# Altium schematic sheet AT32UC3B0256 Breakout Top Assembly.SchDoc
size Letter
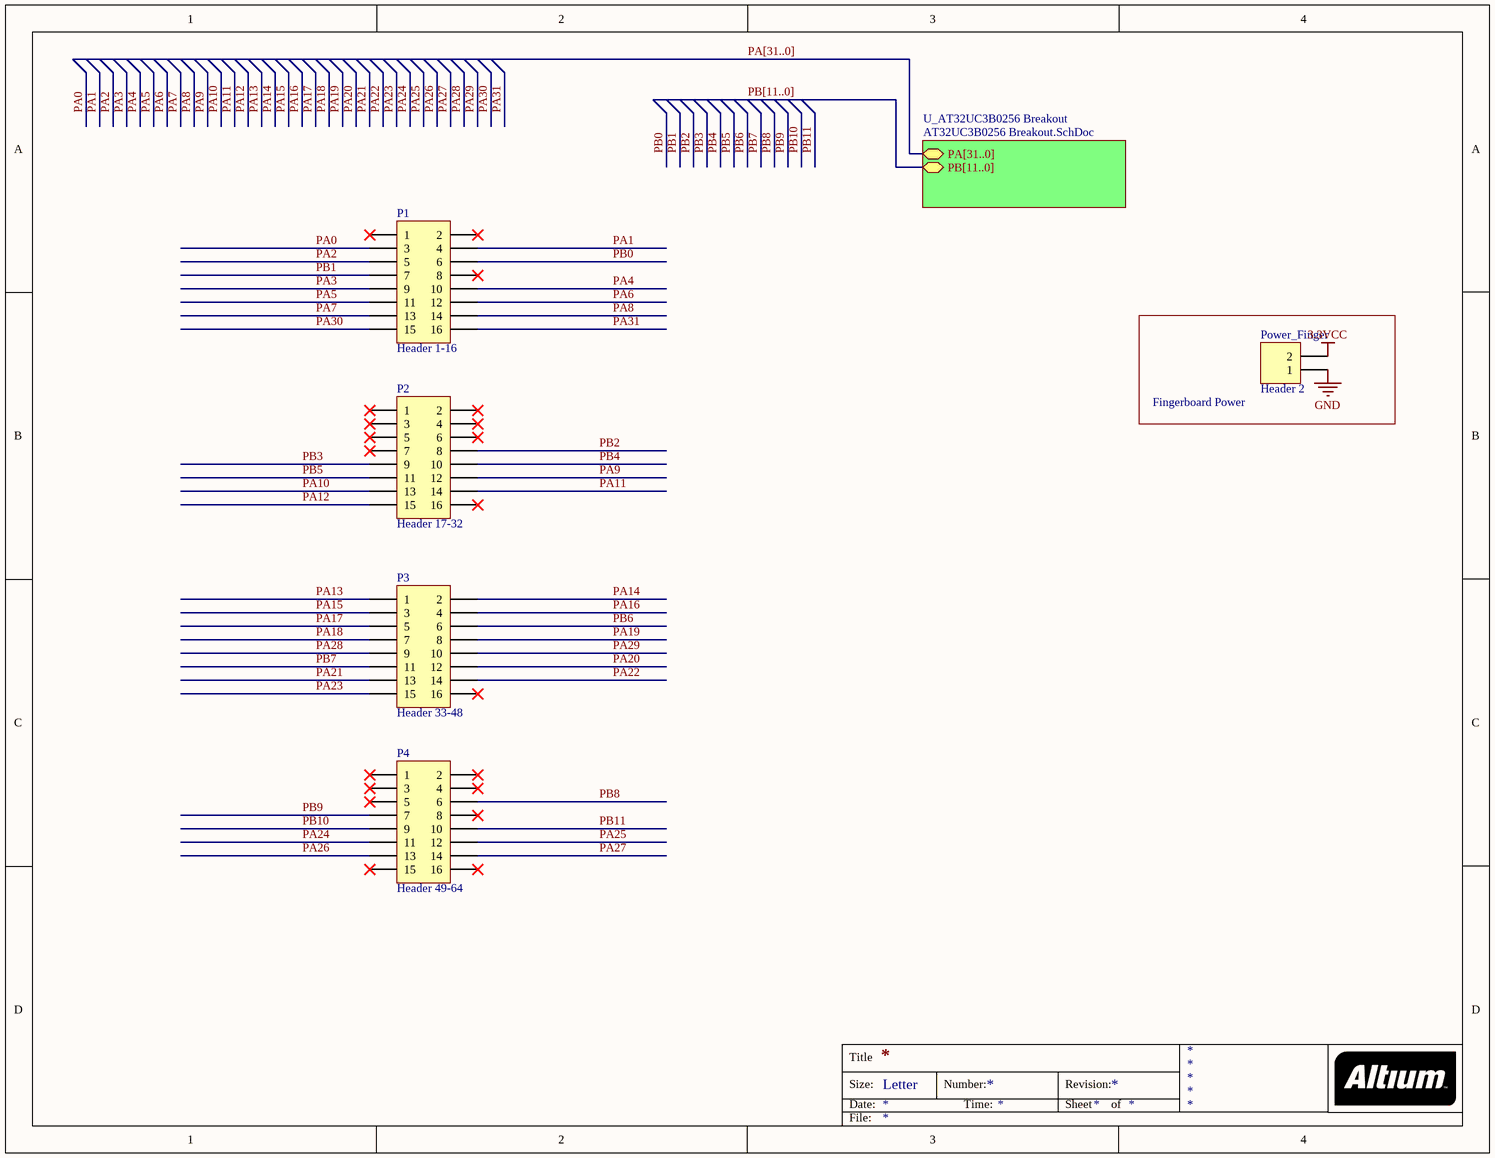
[diagram p0: AT32UC3B0256 Breakout Top Assembly.SchDoc]

## Parts
P1  Header 1-16  [HDR2X8]
P2  Header 17-32  [HDR2X8]
P3  Header 33-48  [HDR2X8]
P4  Header 49-64  [HDR2X8]
Power_Finger  Header 2  [HDR1X2]

## Blocks framed on the sheet
Fingerboard Power: Power_Finger

## Sub-sheets
U_AT32UC3B0256 Breakout = AT32UC3B0256 Breakout.SchDoc: PA[31..0] (bidir), PB[11..0] (bidir)

## Nets
3.3VCC: Power_Finger.2
GND: Power_Finger.1
PA0: P1.3
PA1: P1.4
PA2: P1.5
PA3: P1.9
PA4: P1.10
PA5: P1.11
PA6: P1.12
PA7: P1.13
PA8: P1.14
PA9: P2.12
PA10: P2.13
PA11: P2.14
PA12: P2.15
PA13: P3.1
PA14: P3.2
PA15: P3.3
PA16: P3.4
PA17: P3.5
PA18: P3.7
PA19: P3.8
PA20: P3.12
PA21: P3.13
PA22: P3.14
PA23: P3.15
PA24: P4.11
PA25: P4.12
PA26: P4.13
PA27: P4.14
PA28: P3.9
PA29: P3.10
PA30: P1.15
PA31: P1.16
PB0: P1.6
PB1: P1.7
PB2: P2.8
PB3: P2.9
PB4: P2.10
PB5: P2.11
PB6: P3.6
PB7: P3.11
PB8: P4.6
PB9: P4.7
PB10: P4.9
PB11: P4.10

Not connected (* = marked no-connect by the designer): P1 1* 2* 8*; P2 1* 2* 3* 4* 5* 6* 7* 16*; P3 16*; P4 1* 2* 3* 4* 5* 8* 15* 16*

## Buses and harness runs
bus PA[31..0] = sheet U_AT32UC3B0256 Breakout/PA[31..0]
bus PB[11..0] = sheet U_AT32UC3B0256 Breakout/PB[11..0]

## Notes on the sheet
- Title
- Size:
- Date:
- Letter
- Number:
- Time:
- Revision:
- Sheet
- of
- File:

## Library data of the parts
P1-P4 = Header 8X2: Header, 8-Pin, Dual row; LatestRevisionDate: 17-Jul-2002; LatestRevisionNote: Re-released for DXP Platform.; Publisher: Altium Limited
Power_Finger = Header 2: Header, 2-Pin; LatestRevisionDate: 17-Jul-2002; LatestRevisionNote: Re-released for DXP Platform.; Publisher: Altium Limited